# Altium schematic sheet Gate Connect.SchDoc
size A; SheetNumber: 6; SheetTotal: 6
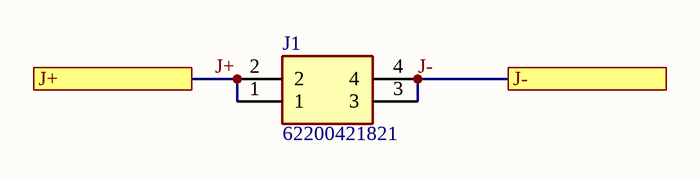
[diagram p0: Gate Connect.SchDoc]

## Parts
J1  62200421821  [62200421821]

## Ports
J+, J-

## Nets
J+: J1.1 J1.2 ; port J+
J-: J1.3 J1.4 ; port J-

## Library data of the parts
J1 = 62200421821: Connector; Manufacturer_Name: Wurth Elektronik; Datasheet Link: https://www.we-online.com/components/products/datasheet/62200421821.pdf; Height: 4.65mm; Manufacturer_Part_Number: 62200421821; Mouser Part Number: 710-62200421821; Mouser Price/Stock: https://www.mouser.co.uk/ProductDetail/Wurth-Elektronik/62200421821?qs=7D1LtPJG0i1S6hjjgxoDmw%3D%3D